# Altium project HUB75onQSPI.PrjPcb
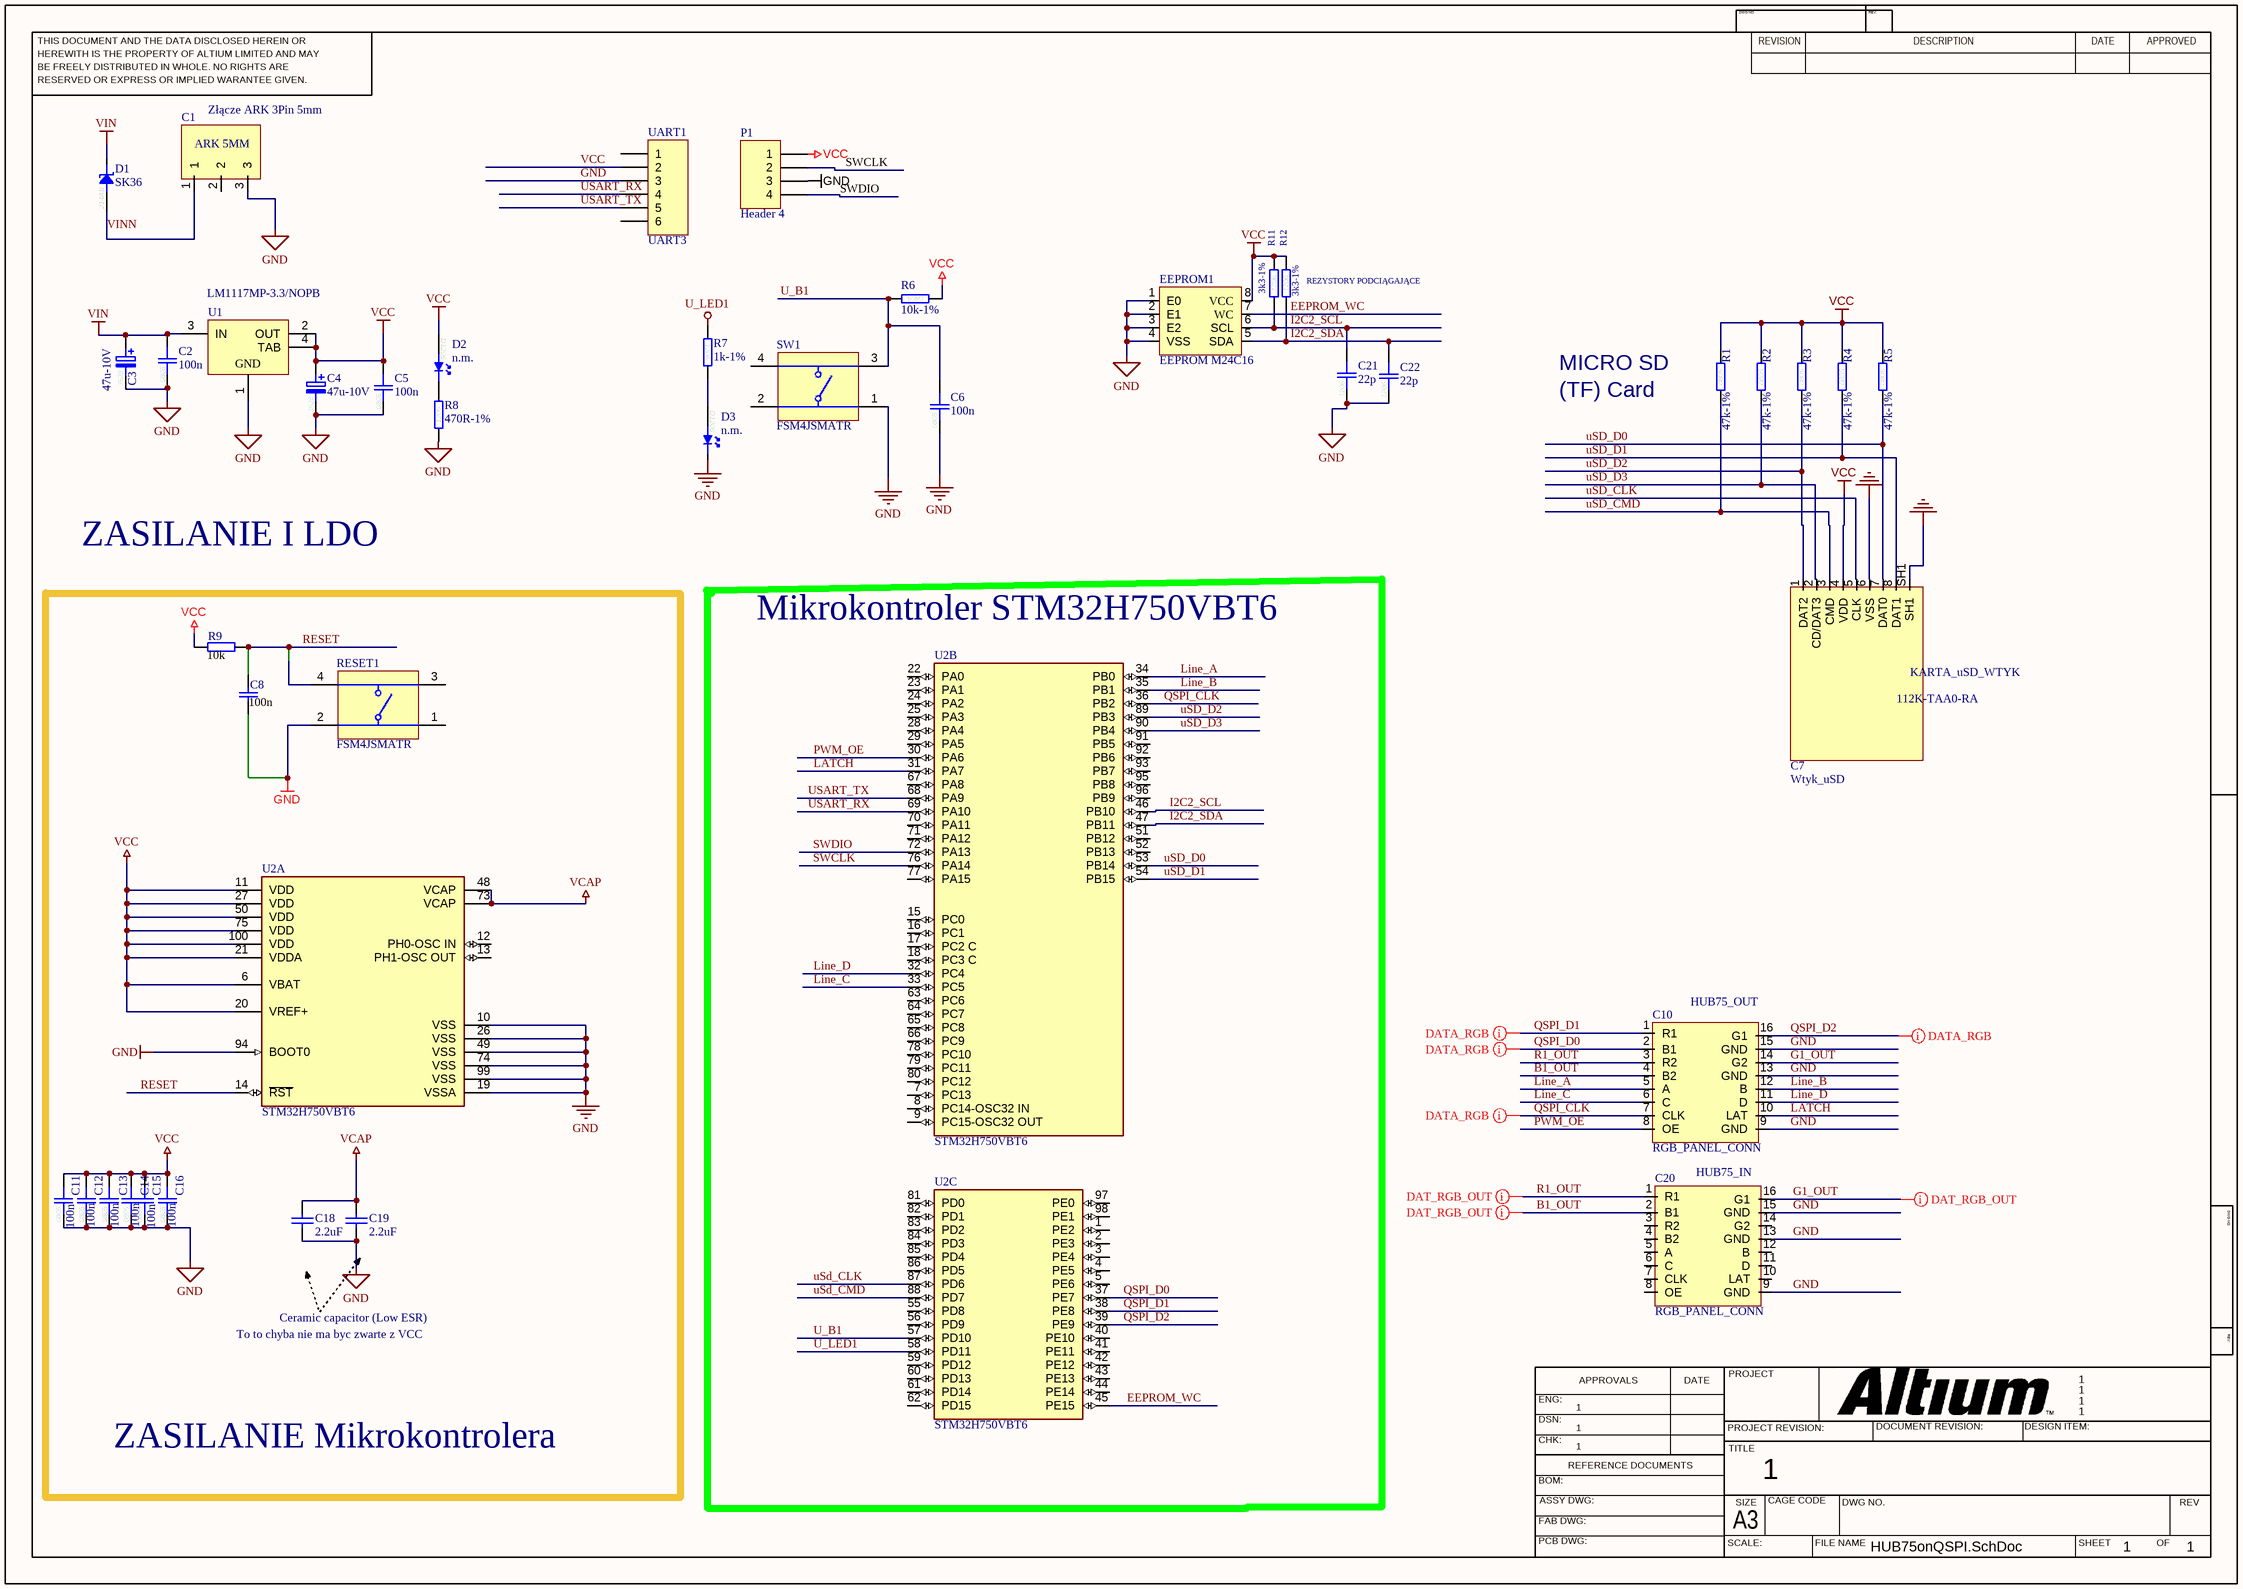
[diagram p0: HUB75onQSPI.SchDoc]
1 sheet, 41 parts. Net scope: global (net labels, ports and power ports of the same name join across sheets).
Board file: HUB75onQSPI.PcbDoc

## Sheet HUB75onQSPI.SchDoc: 1
size 420 x 297 mm; ApprovedBy: 1; CheckedBy: 1; Author: 1; CompanyName: 1; DrawnBy: 1; Engineer: 1; Organization: 1; Address1: 1; Address2: 1; Address3: 1; Address4: 1; DocumentNumber: 1; Revision: 1; SheetNumber: 1; SheetTotal: 1; ImagePath: 1; Application_BuildNumber: 1

### Parts
C1  Złącze ARK 3Pin 5mm  [ARK_3pin_5MM]
C2  100n  [0805C]
C3  47u-10V  [3528-SMDB]
C4  47u-10V  [3528-SMDB]
C5  100n  [0805C]
C6  100n  [0805C]
C7  Wtyk_uSD  [112K-TAA0-RA1]
C8  100n  [0805C]
C10  RGB_PANEL_CONN  [RGB_MATRIX_LED_CONNECTOR]
C11  100n  [0805C]
C12  100n  [0805C]
C13  100n  [0805C]
C14  100n  [0805C]
C15  100n  [0805C]
C16  100n  [0805C]
C18  2.2uF  [1206C]
C19  2.2uF  [1206C]
C20  RGB_PANEL_CONN  [RGB_MATRIX_LED_CONNECTOR]
C21  22p  [1206C]
C22  22p  [1206C]
D1  SK36  [DO214AB]
D2  n.m.  [D1206]  (no BOM)
D3  n.m.  [D1206_1]  (no BOM)
EEPROM1  EEPROM M24C16  [SOP8EEPROM]
P1  Header 4  [HDR1X4]
R1  47k-1%  [0805R]
R2  47k-1%  [0805R]
R3  47k-1%  [0805R]
R4  47k-1%  [0805R]
R5  47k-1%  [0805R]
R6  10k-1%  [0805R]
R7  1k-1%  [1206R]
R8  470R-1%  [1206R]
R9  10k  [0805C]
R11  3k3-1%  [1206R]
R12  3k3-1%  [1206R]
RESET1  FSM4JSMATR  [TECO-FSM4JSMATR_V]
SW1  FSM4JSMATR  [TECO-FSM4JSMATR_V]
U1  LM1117MP-3.3/NOPB  [DCY0004A_L]
U2  STM32H750VBT6  [FP-LQFP100-1L-MFG]  (parts A,B,C of 3)
UART1  UART3  [HDR1X6]

### Blocks framed on the sheet
ZASILANIE Mikrokontrolera: C8 C11-C16 C18 C19 R9 RESET1 U2

### Nets
GND: C1.3 C2.2 C3.2 C4.2 C5.2 C6.2 C7.6(VSS) C7.SH1 C8.2 C10.9(GND) C10.13(GND) C10.15(GND) C11.2 C12.2 C13.2 C14.2 C15.2 C16.2 C18.1 C19.1 C20.9(GND) C20.13(GND) C20.15(GND) C21.2 C22.2 D3.1(K) EEPROM1.1(E0) EEPROM1.2(E1) EEPROM1.3(E2) EEPROM1.4(VSS) P1.3 R8.2 RESET1.2 SW1.1 U1.1(GND) U2.10(VSS) U2.19(VSSA) U2.26(VSS) U2.49(VSS) U2.74(VSS) U2.94(BOOT0) U2.99(VSS) UART1.3
U_LED1: R7.2 U2.58(PD11)
VCAP: C18.2 C19.2 U2.48(VCAP) U2.73(VCAP)
VCC: C4.1 C5.1 C7.4(VDD) C11.1 C12.1 C13.1 C14.1 C15.1 C16.1 D2.2(A) EEPROM1.8(VCC) P1.1 R1.1 R2.1 R3.1 R4.1 R5.1 R6.2 R9.1 R11.1 R12.1 U1.2(OUT) U1.4(TAB) U2.6(VBAT) U2.11(VDD) U2.20(VREF+) U2.21(VDDA) U2.27(VDD) U2.50(VDD) U2.75(VDD) U2.100(VDD) UART1.2
VIN: C2.1 C3.1 D1.1(K) U1.3(IN)
B1_OUT: C10.4(B2) C20.2(B1)
EEPROM_WC: EEPROM1.7(WC) U2.45(PE15)
G1_OUT: C10.14(G2) C20.16(G1)
I2C2_SCL: C21.1 EEPROM1.6(SCL) R11.2 U2.46(PB10)
I2C2_SDA: C22.1 EEPROM1.5(SDA) R12.2 U2.47(PB11)
LATCH: C10.10(LAT) U2.31(PA7)
Line_A: C10.5(A) U2.34(PB0)
Line_B: C10.12(B) U2.35(PB1)
Line_C: C10.6(C) U2.33(PC5)
Line_D: C10.11(D) U2.32(PC4)
PWM_OE: C10.8(OE) U2.30(PA6)
QSPI_CLK: C10.7(CLK) U2.36(PB2)
QSPI_D0: C10.2(B1) U2.37(PE7)
QSPI_D1: C10.1(R1) U2.38(PE8)
QSPI_D2: C10.16(G1) U2.39(PE9)
R1_OUT: C10.3(R2) C20.1(R1)
RESET: C8.1 R9.2 RESET1.4 U2.14(~{RST})
SWCLK: P1.2 U2.76(PA14)
SWDIO: P1.4 U2.72(PA13)
U_B1: C6.1 R6.1 SW1.3 U2.57(PD10)
USART_RX: U2.69(PA10) UART1.4
USART_TX: U2.68(PA9) UART1.5
uSD_CLK: C7.5(CLK) U2.87(PD6)
uSD_CMD: C7.3(CMD) R1.2 U2.88(PD7)
uSD_D0: C7.7(DAT0) R5.2 U2.53(PB14)
uSD_D1: C7.8(DAT1) R4.2 U2.54(PB15)
uSD_D2: C7.1(DAT2) R3.2 U2.89(PB3)
uSD_D3: C7.2(CD/DAT3) R2.2 U2.90(PB4)
VINN: C1.1 D1.2(A)
NetD2_1: D2.1(K) R8.1
NetD3_2: D3.2(A) R7.1

Not connected (* = marked no-connect by the designer): C1 2; C20 3(R2) 4(B2) 5(A) 6(C) 7(CLK) 8(OE) 10(LAT) 11(D) 12(B) 14(G2); RESET1 1 3; SW1 2 4; U2 1(PE2) 2(PE3) 3(PE4) 4(PE5) 5(PE6) 7(PC13) 8(PC14-OSC32_IN) 9(PC15-OSC32_OUT) 12(PH0-OSC_IN) 13(PH1-OSC_OUT) 15(PC0) 16(PC1) 17(PC2_C) 18(PC3_C) 22(PA0) 23(PA1) 24(PA2) 25(PA3) 28(PA4) 29(PA5) 40(PE10) 41(PE11) 42(PE12) 43(PE13) 44(PE14) 51(PB12) 52(PB13) 55(PD8) 56(PD9) 59(PD12) 60(PD13) 61(PD14) 62(PD15) 63(PC6) 64(PC7) 65(PC8) 66(PC9) 67(PA8) 70(PA11) 71(PA12) 77(PA15) 78(PC10) 79(PC11) 80(PC12) 81(PD0) 82(PD1) 83(PD2) 84(PD3) 85(PD4) 86(PD5) 91(PB5) 92(PB6) 93(PB7) 95(PB8) 96(PB9) 97(PE0) 98(PE1); UART1 1 6

### Layout directives
net class DAT_RGB; rule Matched Net Lengths [Tolerance = 2mm]: QSPI_CLK, QSPI_D0, QSPI_D1, QSPI_D2
net class DAT_RGB_OUT; rule Matched Net Lengths [Tolerance = 2mm]: B1_OUT, G1_OUT, R1_OUT

### Notes on the sheet
- REZYSTORY PODCIĄGAJĄCE
- MICRO SD
- (TF) Card
- ZASILANIE I LDO
- (near U2) Mikrokontroler STM32H750VBT6
- (near C10) HUB75_OUT
- (near C20) HUB75_IN
- To to chyba nie ma byc zwarte z VCC
- Ceramic capacitor (Low ESR)
- THIS DOCUMENT AND THE DATA DISCLOSED HEREIN OR
- HEREWITH IS THE PROPERTY OF ALTIUM LIMITED AND MAY
- DWG NO:
- REVISION
- REV:
- DESCRIPTION
- DATE
- APPROVED
- BE FREELY DISTRIBUTED IN WHOLE. NO RIGHTS ARE
- RESERVED OR EXPRESS OR IMPLIED WARANTEE GIVEN.
- ENG:
- APPROVALS
- PROJECT
- DSN:
- CHK:
- REFERENCE DOCUMENTS
- PROJECT REVISION:
- TITLE
- DOCUMENT REVISION:
- DESIGN ITEM:
- BOM:
- FAB DWG:
- PCB DWG:
- ASSY DWG:
- SCALE:
- A3
- SIZE
- CAGE CODE
- FILE NAME
- DWG NO.
- SHEET
- OF
- REV
- (in symbol 1k-1%  1206) 1206
- (in symbol 3k3-1%  1206) 1206
- (in symbol 10k-1%  0805) 0805
- (in symbol 10n  0805) 0805
- (in symbol 22p  1206) 1206
- (in symbol 47k-1%  0805) 0805
- (in symbol 47u-10V  3528) 3528
- (in symbol 100n  0805) 0805
- (in symbol 112K-TAA0-RA1) KARTA_uSD_WTYK; 112K-TAA0-RA
- (in symbol 470R-1%  1206) 1206
- (in symbol n.m.  D1206) D1206
- (in symbol n.m.  D1206_1) D1206
- (in symbol SK36  DO214AB) 214AB
- (in symbol Złącze ARK 3Pin 5mm) ARK 5MM

### Library data of the parts
C2 C5 C6 = 100n  0805: Kond. ceramiczny X7R  50V  10%; Indeks: 5566; Nazwa: 100n
C3 C4 = 47u-10V  3528: Kond. tantalowy  B  10V  20%; Indeks: 4032; Nazwa: 47u-10V
C7 = 112K-TAA0-RA1
C8 = KOND: Kondensator
C10 C20 = Connector_MATRIX_LED_RGB: Pamietac o tym aby zrobic jakies zworki na to zeby te wyjscia polaczyc z wejsciami to tam wiadomix 2 takie connectory potrzebne beda / Do tego warto zwrocic uwage ze ku**y sie krzyzuja więc to nie jest tak prosto połączyć
C11-C16 = 10n  0805: Kond. ceramiczny X7R  50V  10%; Nazwa: 10n
C18 C19 = Cap_2.2uF_X7R_10%_1206: Capacitor,2.2uF,16V, X7R,10%,1206,YAGEO; Manuf_Part_1: CC1206KKX7R7BB225; Manuf_Part_2: C1206C225K4RAC; Manuf_2: KEMET; Revision: July-2002: Re-released for DXP Platform.; Value: 2.2uF; Order: CC1206KKX7R7BB225; Manuf_1: YAGEO; ECCN_US/EU: n/a
C21 C22 = 22p  1206: Kond. ceramiczny NP0  50V; Nazwa: 22p
D1 = SK36  DO214AB: Dioda Schottky  60V  IF=3A  VF=0,75V; Index: 9145; Nazwa: SK36
D2 = n.m.  D1206: Dioda LED; Index: -; Nazwa: n.m.
D3 = n.m.  D1206_1: Dioda LED HongliTronic; Index: -; Nazwa: n.m.
P1 = Header 4: Header, 4-Pin; LatestRevisionDate: 17-Jul-2002; LatestRevisionNote: Re-released for DXP Platform.; Publisher: Altium Limited
R1-R5 = 47k-1%  0805: Rezystor 0,125W; Nazwa: 47k-1%
R6 = 10k-1%  0805: Rezystor 0,125W; Nazwa: 10k-1%
R7 = 1k-1%  1206: Rezystor 0,25W; Nazwa: 1k-1%
R8 = 470R-1%  1206: Rezystor 0,25W; Nazwa: 470R-1%
R9 = RES2: Rezystor
R11 R12 = 3k3-1%  1206: Rezystor 0,25W; Nazwa: 3k3-1%
RESET1 SW1 = CMP-2000-07486-1: Micro Miniature Push Button Switch FSM JSM, 50 mA, -35 to 85 degC, 4-Pin SMD, RoHS, Tape and Reel; Manufacturer: TE Connectivity; Mechanical Life: 100000Cycles; Current Rating: 50mA; Actuator Material: Polyamide; Max Voltage Rating (DC): 12V; Capacitance: 0f; Illumination Type: Illuminated; Voltage Rating (DC): 24V; Case\/Package: SMD/SMT; Operating Force: 160gf; Contact Resistance: 100mOhm; Actuator Length: 0.055inch; Switch Travel: 0.25mm; Throw Configuration: SPST; Termination: GullWing; Contact Plating: Silver; Orientation: Straight; Mounting Technology: SurfaceMount; REACH SVHC: Unknown; Electrical Life: 100000Cycles; Package Reference: FSM4JSMATR; Max Operating Temperature: 85degC; Manufacturer URL: http://www.te.com/; Package Description: 4-Pin Surface Mount Device, Body 6 x 6 mm, Pitch 4.5 mm; Datasheet Version: Rev. V, 02/2015; Packaging: TapeandReel; Min Operating Temperature: -35degC; Mount: SurfaceMount; Contact Current Rating: 50mA; Contact Material: CopperAlloy; Package Quantity: 1200; Datasheet URL: http://www.te.com/commerce/DocumentDelivery/DDEController?Action=showdoc&DocId=Customer+Drawing%7F2-1437565-7%7FV%7Fpdf%7FEnglish%7FENG_CD_2-1437565-7_V.pdf%7F4-1437565-2; RoHSCompliant: true
U1 = CMP-0062-01638-4: 800mA Low-Dropout Linear Regulator, 4-pin SOT-223, Pb-Free; Manufacturer: Texas Instruments; CompType: LDO IC; PackageTopMarking: XYTT*N05A; High-Reliability: Y; PowerWise: N; ComponentLink1URL: http://www.ti.com/general/docs/lit/getliterature.tsp?genericPartNumber=LM1117-N&fileType=pdf; PinCount: 4; PackageDescription: Molded SOT-223, 6.50 x 3.56 x 1.6mm Body, 4 Lead, 2.3mm Pitch; Code_IPC: SOT223-4; PartNumber: LM1117MP-3.3/NOPB; Code_JEDEC: TO-261-AA; RoHS: Y; PackageReference: DCY0004A; ComponentLink1Description: Datasheet URL
U2 = CMP-12105-000017-1: IC MCU 32BIT 128KB FLASH 100LQFP; Manufacturer: STMicroelectronics; Number Of Uart Channels: 9; Number Of I/Os: 82; Max Junction Temp: +125°C; Data Bus Width: 32bits; Ram Size: 1MBytes; Min Supply Voltage: 1.62V; Number Of Spi Channels: 6; Number Of Adc Channels: 36; Max Supply Voltage: 3.6V; Standoff Height: 0.05mm; Interface: I2C,SPI,UART,USART,CAN,USB,LIN,IrDA,Ethernet,I2S,Other; Number Of A/D Converters: 3; Number Of I2C Channels: 4; Memory Size: 128KBytes; Frequency: 480MHz; Number Of Timers/Counters: 20; Number Of Ethernet Channels: 1; Core Architecture: ARM Cortex-M7; Number Of Usb Channels: 2; Number Of Pwm Channels: 42; Ambient Temperature Range High: +85°C; Temperature: -40°C to +125°C; ComponentLink2URL: https://www.st.com/resource/en/datasheet/stm32h750vb.pdf; Device Class L2: Embedded Processors and Controllers; Temperature Range Low: -40°C; Octopart: https://octopart.com/stm32h750vbt6-stmicroelectronics-94048547; Category: IC; Manufacturer Part Number: STM32H750VBT6; Height: 1.6mm; Lead Free: Yes; Device Class L1: Integrated Circuits (ICs); Digikey Description: IC MCU 32BIT 128KB FLASH 100LQFP; RoHS: TRUE; Ambient Temperature Range Low: -40°C; Device Class L3: Microcontrollers; ComponentLink2Description: Datasheet; Mouser Description: MCU 32-Bit STM32H750VB ARM Cortex M7 RISC 128KB Flash 1.8V/2.5V/3.3V 100-Pin LQFP Tray; Number Of Cores: 1; Automotive: No; Memory Type: FLASH; Package: LQFP100-1L; Temperature Range High: +125°C
UART1 = Header 6: Header, 6-Pin; LatestRevisionDate: 17-Jul-2002; LatestRevisionNote: Re-released for DXP Platform.; Publisher: Altium Limited